# Altium project Autobot_project.PrjPcb
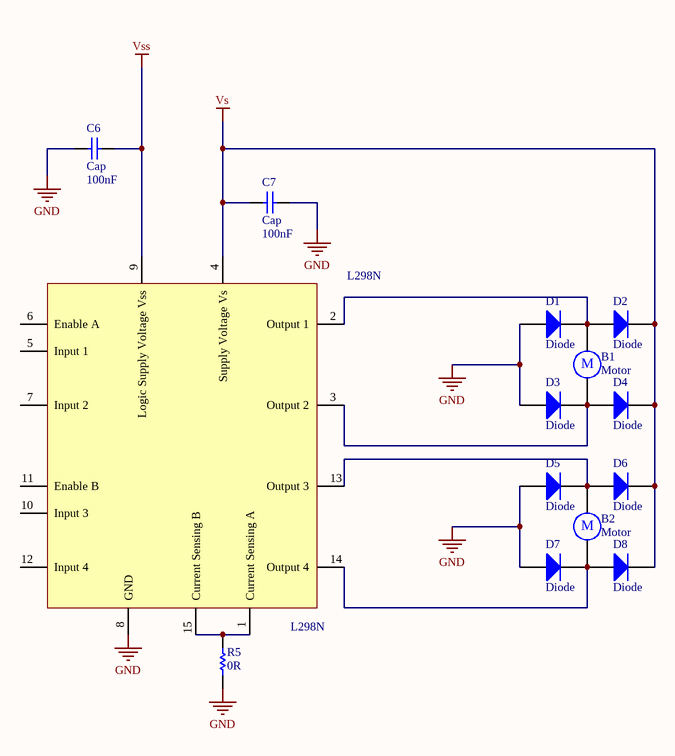
[diagram p0: MotorControl.SchDoc]
2 sheets, 28 parts. Net scope: flat (ports and power ports of the same name join across sheets).
Board file: PCB_Autobot.PcbDoc
Sheets:
  MotorControl.SchDoc
  PICZone.SchDoc

## Sheet MotorControl.SchDoc: Motor Control
size A4; Organization: Autobot Limited; Address1: 96, boulevard Bessiere; Address4: 75017 PARIS; SheetNumber: 2

### Parts
B1  Motor  [RB5-10.5]
B2  Motor  [RB5-10.5]
C6  Cap  value 100nF  [RAD-0.3]
C7  Cap  value 100nF  [RAD-0.3]
D1  Diode  [SMC]
D2  Diode  [SMC]
D3  Diode  [SMC]
D4  Diode  [SMC]
D5  Diode  [SMC]
D6  Diode  [SMC]
D7  Diode  [SMC]
D8  Diode  [SMC]
L298N  L298N  [L298N]
R5  0R  [AXIAL-0.3]

### Nets
GND: C6.2 C7.2 D1.1(A) D3.1(A) D5.1(A) D7.1(A) L298N.8(GND) R5.1
Vs: C7.1 D2.2(K) D4.2(K) D6.2(K) D8.2(K) L298N.4(Supply_Voltage_Vs)
Vss: C6.1 L298N.9(Logic_Supply_Voltage_Vss)
NetB1_1: B1.1 D1.2(K) D2.1(A) L298N.2(Output_1)
NetB1_2: B1.2 D3.2(K) D4.1(A) L298N.3(Output_2)
NetB2_1: B2.1 D5.2(K) D6.1(A) L298N.13(Output_3)
NetB2_2: B2.2 D7.2(K) D8.1(A) L298N.14(Output_4)
NetL298N_1: L298N.1(Current_Sensing_A) L298N.15(Current_Sensing_B) R5.2

Not connected (* = marked no-connect by the designer): L298N 5(Input_1) 6(Enable_A) 7(Input_2) 10(Input_3) 11(Enable_B) 12(Input_4)

### Notes on the sheet
- Title
- Size:
- Date:
- A4
- Number:
- Time:
- Revision:
- Sheet
- of
- File:
- (in symbol Motor) M

### Library data of the parts
B1 B2 = Motor: Motor, General Kind; Fournisseur: Olimex; Published: 24-Mar-1999; LatestRevisionDate: 17-Jul-2002; LatestRevisionNote: Re-released for DXP Platform.; PackageReference: RB5-10.5; Publisher: Altium Limited; PackageDescription: Capacitor (Radial); 2 Leads
C6 C7 = Cap: Capacitor; Published: 8-Jun-2000; LatestRevisionDate: 17-Jul-2002; LatestRevisionNote: Re-released for DXP Platform.; PackageReference: RAD-0.3; Publisher: Altium Limited; PackageDescription: Radial Cap, Thru-Hole; 2 Leads; 0.3 in Pin Spacing
D1-D8 = Diode: Default Diode; Fabricant: DIODES INC.; Fournisseur: Farnell; RefFabricant: MURS140-13-F; RefFournisseur: 1858656; Published: 8-Jun-2000; LatestRevisionDate: 17-Jul-2002; LatestRevisionNote: Re-released for DXP Platform.; PackageVersion: Sep-1996; PackageReference: SMC; Publisher: Altium Limited; PackageDescription: DO-214-AB/SMC; 2 C-Bend Leads; Body 7.9 x 5.9 mm, inc. leads (LxW); Code_JEDEC: DO-214-AB
L298N = L298N: Fabricant: STMICROELECTRONICS; Fournisseur: Farnell; RefFournisseur: 403295; RefFabricant: L298N
R5 = Res1: Resistor; Published: 8-Jun-2000; LatestRevisionDate: 17-Jul-2002; LatestRevisionNote: Re-released for DXP Platform.; PackageReference: AXIAL-0.3; Publisher: Altium Limited; PackageDescription: Axial Device, Thru-Hole; 2 Leads; 0.3 in Pin Spacing; Value: 0R

## Sheet PICZone.SchDoc: PIC
size A4; Organization: Autobot Limited; Address1: 96, boulevard Bessiere; Address4: 75017 PARIS; SheetNumber: 3
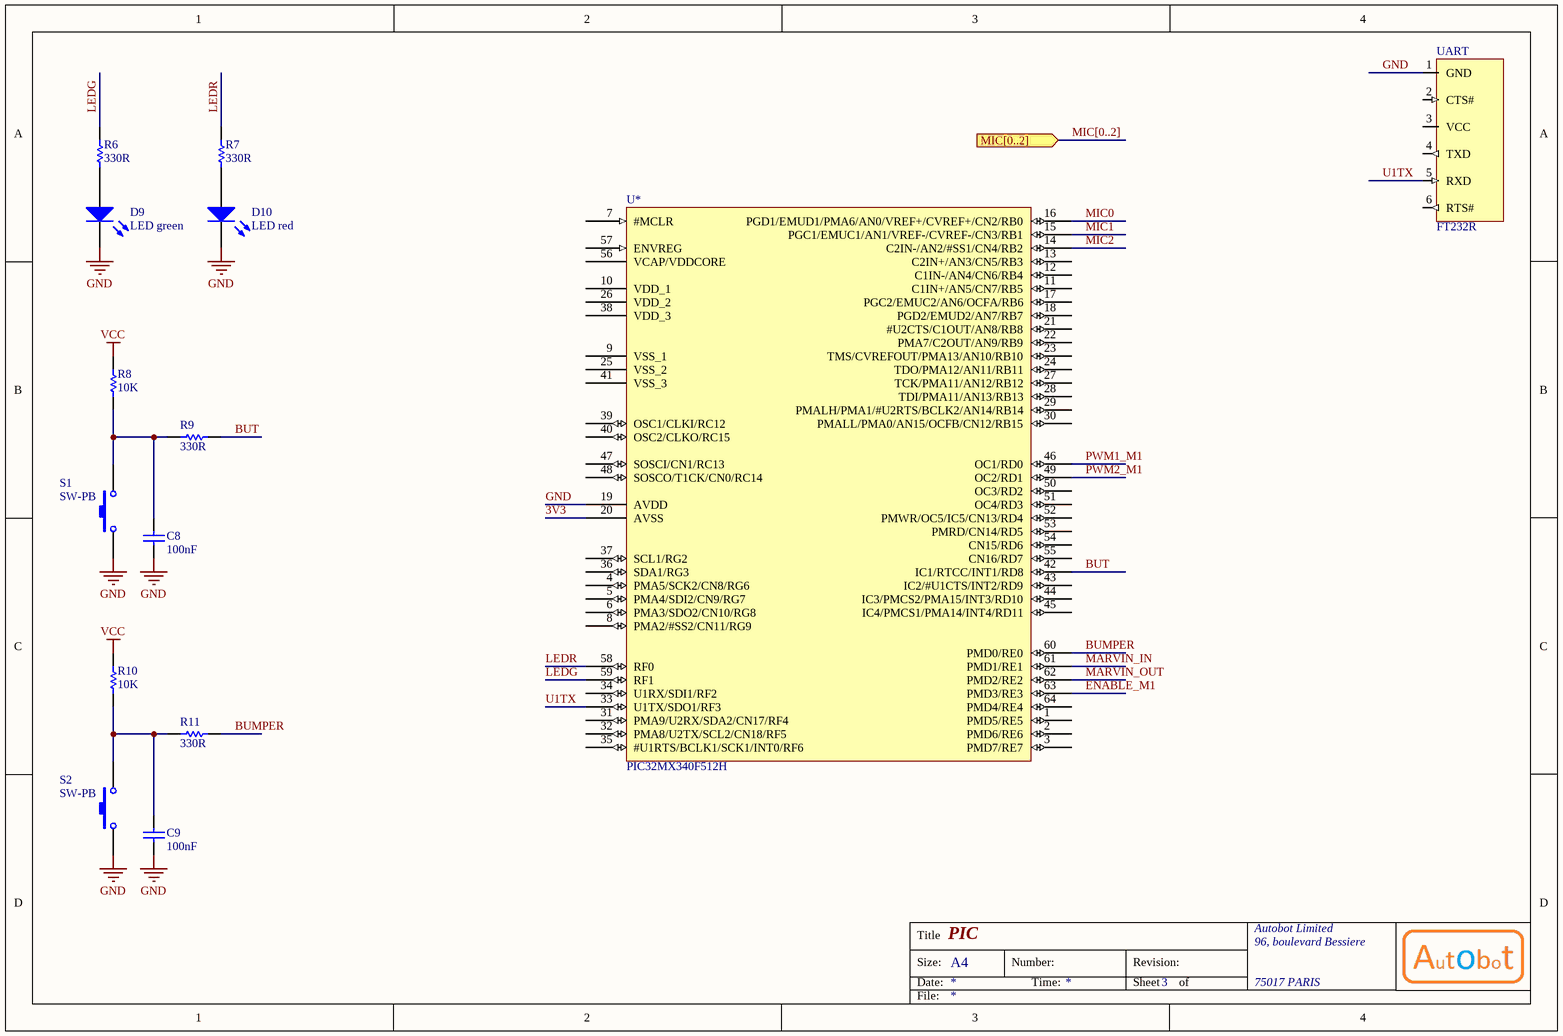
[diagram p1: PICZone.SchDoc]

### Parts
C8  100nF  [RAD-0.3]
C9  100nF  [RAD-0.3]
D9  LED green  [LED-0]
D10  LED red  [LED-0]
R6  330R  [AXIAL-0.3]
R7  330R  [AXIAL-0.3]
R8  10K  [AXIAL-0.3]
R9  330R  [AXIAL-0.3]
R10  10K  [AXIAL-0.3]
R11  330R  [AXIAL-0.3]
S1  SW-PB  [SPST-2]
S2  SW-PB  [SPST-2]
U*  PIC32MX340F512H
UART  FT232R

### Ports
MIC[0..2] (in)

### Nets
GND: C8.2 C9.2 D9.2(K) D10.2(K) S1.1 S2.1 U*.19(AVDD) UART.1(GND)
VCC: R8.2 R10.2
3V3: U*.20(AVSS)
BUMPER: R11.1 U*.60(PMD0/RE0)
BUT: R9.1 U*.42(IC1/RTCC/INT1/RD8)
ENABLE_M1: U*.63(PMD3/RE3)
LEDG: R6.2 U*.59(RF1)
LEDR: R7.2 U*.58(RF0)
MARVIN_IN: U*.61(PMD1/RE1)
MARVIN_OUT: U*.62(PMD2/RE2)
MIC0: U*.16(PGD1/EMUD1/PMA6/AN0/VREF+/CVREF+/CN2/RB0)
MIC1: U*.15(PGC1/EMUC1/AN1/VREF-/CVREF-/CN3/RB1)
MIC2: U*.14(C2IN-/AN2/#SS1/CN4/RB2)
PWM1_M1: U*.46(OC1/RD0)
PWM2_M1: U*.49(OC2/RD1)
U1TX: U*.33(U1TX/SDO1/RF3) UART.5(RXD)
NetC8_1: C8.1 R8.1 R9.2 S1.2
NetC9_1: C9.1 R10.1 R11.2 S2.2
NetD9_1: D9.1(A) R6.1
NetD10_1: D10.1(A) R7.1

Not connected (* = marked no-connect by the designer): U* 1(PMD5/RE5) 2(PMD6/RE6) 3(PMD7/RE7) 4(PMA5/SCK2/CN8/RG6) 5(PMA4/SDI2/CN9/RG7) 6(PMA3/SDO2/CN10/RG8) 7(#MCLR) 8(PMA2/#SS2/CN11/RG9) 9(VSS_1) 10(VDD_1) 11(C1IN+/AN5/CN7/RB5) 12(C1IN-/AN4/CN6/RB4) 13(C2IN+/AN3/CN5/RB3) 17(PGC2/EMUC2/AN6/OCFA/RB6) 18(PGD2/EMUD2/AN7/RB7) 21(#U2CTS/C1OUT/AN8/RB8) 22(PMA7/C2OUT/AN9/RB9) 23(TMS/CVREFOUT/PMA13/AN10/RB10) 24(TDO/PMA12/AN11/RB11) 25(VSS_2) 26(VDD_2) 27(TCK/PMA11/AN12/RB12) 28(TDI/PMA11/AN13/RB13) 29(PMALH/PMA1/#U2RTS/BCLK2/AN14/RB14) 30(PMALL/PMA0/AN15/OCFB/CN12/RB15) 31(PMA9/U2RX/SDA2/CN17/RF4) 32(PMA8/U2TX/SCL2/CN18/RF5) 34(U1RX/SDI1/RF2) 35(#U1RTS/BCLK1/SCK1/INT0/RF6) 36(SDA1/RG3) 37(SCL1/RG2) 38(VDD_3) 39(OSC1/CLKI/RC12) 40(OSC2/CLKO/RC15) 41(VSS_3) 43(IC2/#U1CTS/INT2/RD9) 44(IC3/PMCS2/PMA15/INT3/RD10) 45(IC4/PMCS1/PMA14/INT4/RD11) 47(SOSCI/CN1/RC13) 48(SOSCO/T1CK/CN0/RC14) 50(OC3/RD2) 51(OC4/RD3) 52(PMWR/OC5/IC5/CN13/RD4) 53(PMRD/CN14/RD5) 54(CN15/RD6) 55(CN16/RD7) 56(VCAP/VDDCORE) 57(ENVREG) 64(PMD4/RE4); UART 2(CTS#) 3(VCC) 4(TXD) 6(RTS#)

### Buses and harness runs
bus MIC[0..2] = port MIC[0..2]

### Notes on the sheet
- Title
- Size:
- Date:
- A4
- Number:
- Time:
- Revision:
- Sheet
- of
- File:

### Library data of the parts
C8 C9 = Cap: Capacitor; Published: 8-Jun-2000; LatestRevisionDate: 17-Jul-2002; LatestRevisionNote: Re-released for DXP Platform.; PackageReference: RAD-0.3; Publisher: Altium Limited; PackageDescription: Radial Cap, Thru-Hole; 2 Leads; 0.3 in Pin Spacing; Value: 100nF
D9 D10 = LED0: Typical INFRARED GaAs LED; Fabricant: DIODES INC.; Fournisseur: Farnell; RefFabricant: MURS140-13-F; RefFournisseur: 1858656; Published: 8-Jun-2000; LatestRevisionDate: 08-Jul-2005; LatestRevisionNote: Mech Layer 1 removed.; PackageReference: LED-0; Publisher: Altium Limited; PackageDescription: LED; 2 Leads
R6-R11 = Res1: Resistor; Published: 8-Jun-2000; LatestRevisionDate: 17-Jul-2002; LatestRevisionNote: Re-released for DXP Platform.; PackageReference: AXIAL-0.3; Publisher: Altium Limited; PackageDescription: Axial Device, Thru-Hole; 2 Leads; 0.3 in Pin Spacing
  R6 R7 R9 R11: Value: 330R
  R8 R10: Value: 10K
S1 = SW-PB: Switch; Fournisseur: Farnell; Published: 24-Mar-1999; LatestRevisionDate: 17-Jul-2002; LatestRevisionNote: Re-released for DXP Platform.; PackageReference: SPST-2; Publisher: Altium Limited; PackageDescription: Switch; 2 Leads
S2 = SW-PB: Switch; Fabricant: MULTICOMP; Fournisseur: Farnell; RefFabricant: R13-509B-05-BR; RefFournisseur: 1634685; Published: 24-Mar-1999; LatestRevisionDate: 17-Jul-2002; LatestRevisionNote: Re-released for DXP Platform.; PackageReference: SPST-2; Publisher: Altium Limited; PackageDescription: Switch; 2 Leads
U* = PIC32MX340F512H: Fournisseur: Farnell
UART = FT232R: Fabricant: MOLEX; Fournisseur: Farnell; RefFournisseur: 9731164; RefFabricant: 22-27-2041

## Nets that join several sheets
GND: MotorControl (8 pins), PICZone (8 pins)